# Altium schematic sheet Microcontroller.SchDoc
size A
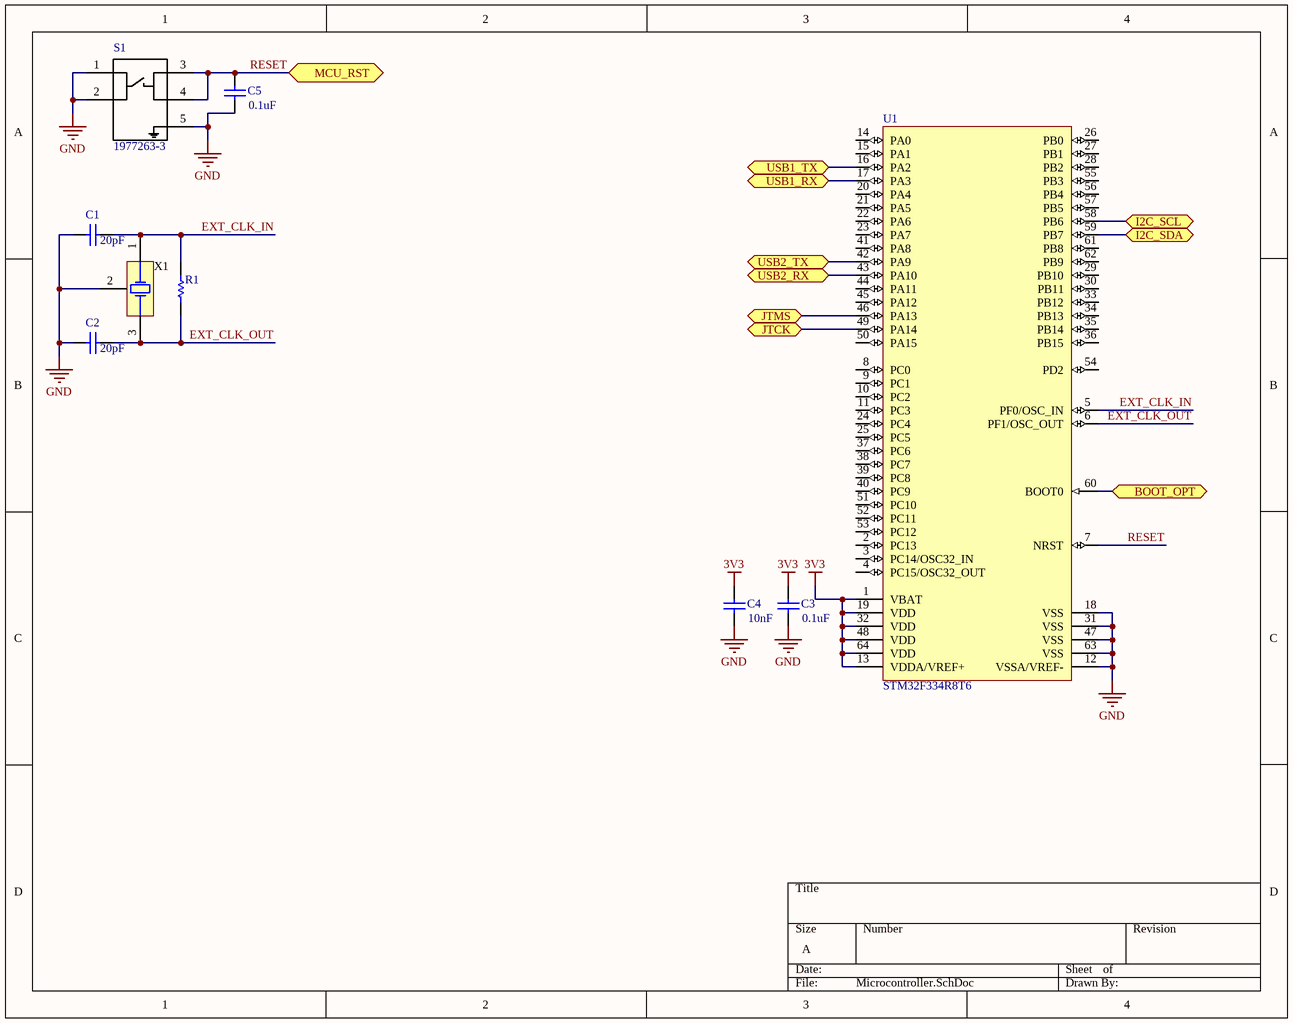
[diagram p0: Microcontroller.SchDoc]

## Parts
C1  value 20pF  [CAPC1206(3216)100_M]  (hidden comment: CAP 20pF 100V 1206(3216))
C2  value 20pF  [CAPC1206(3216)100_M]  (hidden comment: CAP 20pF 100V 1206(3216))
C3  value 0.1uF  [CAPC3216X100X50LL20T25]  (hidden comment: C1206F104K3RACTU)
C4  Capacitance: 10nF  [CAPC3216X88X50LL20T25]  (hidden comment: C1206C103K1RAC)
C5  value 0.1uF  [CAPC3216X100X50LL20T25]  (hidden comment: C1206F104K3RACTU)
R1  1M8 5% 1206(3216)  [RESC1206(3216)_M]  (value not drawn)
S1  1977263-3  [SW_1977263-3]
U1  STM32F334R8T6  [STM-LQFP64_L]
X1  ECS-200-20-4X-3IL  [ECS-4X-3IL]  (value not drawn)

## Ports
BOOT_OPT (bidir), I2C_SCL (bidir), I2C_SDA (bidir), JTCK (bidir), JTMS (bidir), MCU_RST (bidir), USB1_RX (bidir), USB1_TX (bidir), USB2_RX (bidir), USB2_TX (bidir)

## Nets
3V3: C3.1 C4.2 U1.1(VBAT) U1.13(VDDA/VREF+) U1.19(VDD) U1.32(VDD) U1.48(VDD) U1.64(VDD)
GND: C1.1 C2.1 C3.2 C4.1 C5.2 S1.1 S1.2 S1.5(GND) U1.12(VSSA/VREF-) U1.18(VSS) U1.31(VSS) U1.47(VSS) U1.63(VSS) X1.2
BOOT_OPT: U1.60(BOOT0) ; port BOOT_OPT
EXT_CLK_IN: C1.2 R1.2 U1.5(PF0/OSC_IN) X1.1
EXT_CLK_OUT: C2.2 R1.1 U1.6(PF1/OSC_OUT) X1.3
I2C_SCL: U1.58(PB6) ; port I2C_SCL
I2C_SDA: U1.59(PB7) ; port I2C_SDA
JTCK: U1.49(PA14) ; port JTCK
JTMS: U1.46(PA13) ; port JTMS
RESET: C5.1 S1.3 S1.4 U1.7(NRST) ; port MCU_RST
USB1_RX: U1.17(PA3) ; port USB1_RX
USB1_TX: U1.16(PA2) ; port USB1_TX
USB2_RX: U1.43(PA10) ; port USB2_RX
USB2_TX: U1.42(PA9) ; port USB2_TX

Not connected (* = marked no-connect by the designer): U1 2(PC13) 3(PC14/OSC32_IN) 4(PC15/OSC32_OUT) 8(PC0) 9(PC1) 10(PC2) 11(PC3) 14(PA0) 15(PA1) 20(PA4) 21(PA5) 22(PA6) 23(PA7) 24(PC4) 25(PC5) 26(PB0) 27(PB1) 28(PB2) 29(PB10) 30(PB11) 33(PB12) 34(PB13) 35(PB14) 36(PB15) 37(PC6) 38(PC7) 39(PC8) 40(PC9) 41(PA8) 44(PA11) 45(PA12) 50(PA15) 51(PC10) 52(PC11) 53(PC12) 54(PD2) 55(PB3) 56(PB4) 57(PB5) 61(PB8) 62(PB9)

## Library data of the parts
C1 C2 = CMP-1037-00946-1: CAP 20pF 100V ±10% 1206 (3216 Metric) Thickness 1mm SMD; Case-Metric: 3216; Case-EIA: 1206; Tolerance: Â±10%; Rated Voltage: 100 V; Max Thickness: 1 mm; Technology: SMT
C3 C5 = CMP-1664-00001-1: CAP CER 0.1UF 25V 10% X7R 1206; PackageReference: 1206; PartNumber: C1206F104K3RACTU; ComponentLink1URL: http://www.kemet.com/docfinder?Partnumber=C1206F104K3RACTU; ComponentLink1Description: Datasheet
C4 = CMP-2000-06007-1: Chip Capacitor, 0.01 uF, +/- 10%, 100 V, -55 to 125 degC, 1206 (3216 Metric), RoHS, Tape and Reel; Manufacturer: Kemet; Ceramic Capacitor Case: 1206[3216Metric]; No. of Pins: 2; SVHC: NoSVHC(16-Dec-2013); Product Range: KEMET-CSeries; Voltage Rating: 100V; Dielectric Characteristic: X7R; Capacitor Terminals: SMD; Operating Temperature Min: -55°C; Datasheet Version: 10/2016; Operating Temperature Range: -55°Cto+125°C; Operating Temperature Max: 125°C; Packaging: CutTape; RoHS Compliant: Yes; MSL: MSL1-Unlimited; Capacitance Tolerance: ±10%; Mounting Technology: SurfaceMount; Package Reference: 1206; Capacitor Case Style: 1206[3216Metric]; Datasheet URL: http://capacitoredge.kemet.com/capedge2/DataSheet/Datasheet-C1206C103K1RAC.pdf?pn=C1206C103K1RAC{BULK}; Package Description: 2-Pin Surface Mount Device, Body 3.2 x 1.6 mm; Manufacturer URL: http://www.kemet.com/
R1 = CMP-1014-00152-1: 1M8 0.25W 5% 1206 (3216 Metric)  SMD; Case-EIA: 1206; Value: 1800000.00 Ohm; Case-Metric: 3216; Tolerance: 5 %; Technology: SMT; Power: 0.25 W
S1 = 1977263-3: Switch Tactile OFF _ON_ SPST Round Button Gull Wing 0.05A 24VDC 1000000Cycle 2.55N SMD Bulk; MF: TE Connectivity / AMP; Price: 0.20 USD; Package: None; MP: 1977263-3; SnapEDA_Link: https://www.snapeda.com/parts/1977263-3/TE%20Connectivity%20/%20AMP/view-part/?ref=snap; Availability: Good; Value: *
U1 = CMP-0537-00077-1: ARM Cortex-M4 32-bit MCU, 64 KB Flash, 16 KB Internal RAM, 51 I/Os, 64-Pin LQFP, -40 to 85 degC, Tray; Supply Voltage(Vcc) min (V): 2; D/A Converter: 3; Internal RAM Size (kB): 16; FLASH Size (Prog) (kB): 64; Operating Frequency(F) (Processor speed) (MHz): 72; I/Os (High Current): 51; ComponentLink1Description: Manufacturer URL; ComponentLink2URL: http://www.st.com/st-web-ui/static/active/en/resource/technical/document/datasheet/DM00097745.pdf; Package Reference: LQFP64; ComponentLink1URL: http://www.st.com/; ComponentLink2Description: Datasheet; DatasheetVersion: Rev. 4; Mounting Technology: Surface Mount; Package Description: 64-Pin Low-profile Quad Flat Package, Body 10 x 10 mm, Pitch 0.5 mm; Packing: Tray; Core: ARM Cortex-M4
X1 = CMP-1669-00004-2: Quartz Crystal, 20 MHz, 20 pF, -10 to 70 degC, 2-Pin THD, RoHS, Bulk; Manufacturer: ECS; Height: 0.138 inch; Mounting Technology: Through Hole; Mount: Through Hole; Length: 0.447 inch; Packaging: Bulk; PackageDescription: 3-Pin Throung Hole Device, Body 11.35 x 4.65 mm; RoHSCompliant: True; Max Operating Temperature: 70 �C; ComponentLink1URL: https://www.ecsxtal.com/; DatasheetVersion: 02/2016; ComponentLink2URL: http://www.ecsxtal.com/store/pdf/hc-49usx.pdf; PackageReference: 4X-3IL; Min Operating Temperature: -10 �C; ComponentLink1Description: Manufacturer URL; Package Quantity: 200; ComponentLink2Description: Datasheet